# Altium project 1814_TotemLumineux.PrjPcb
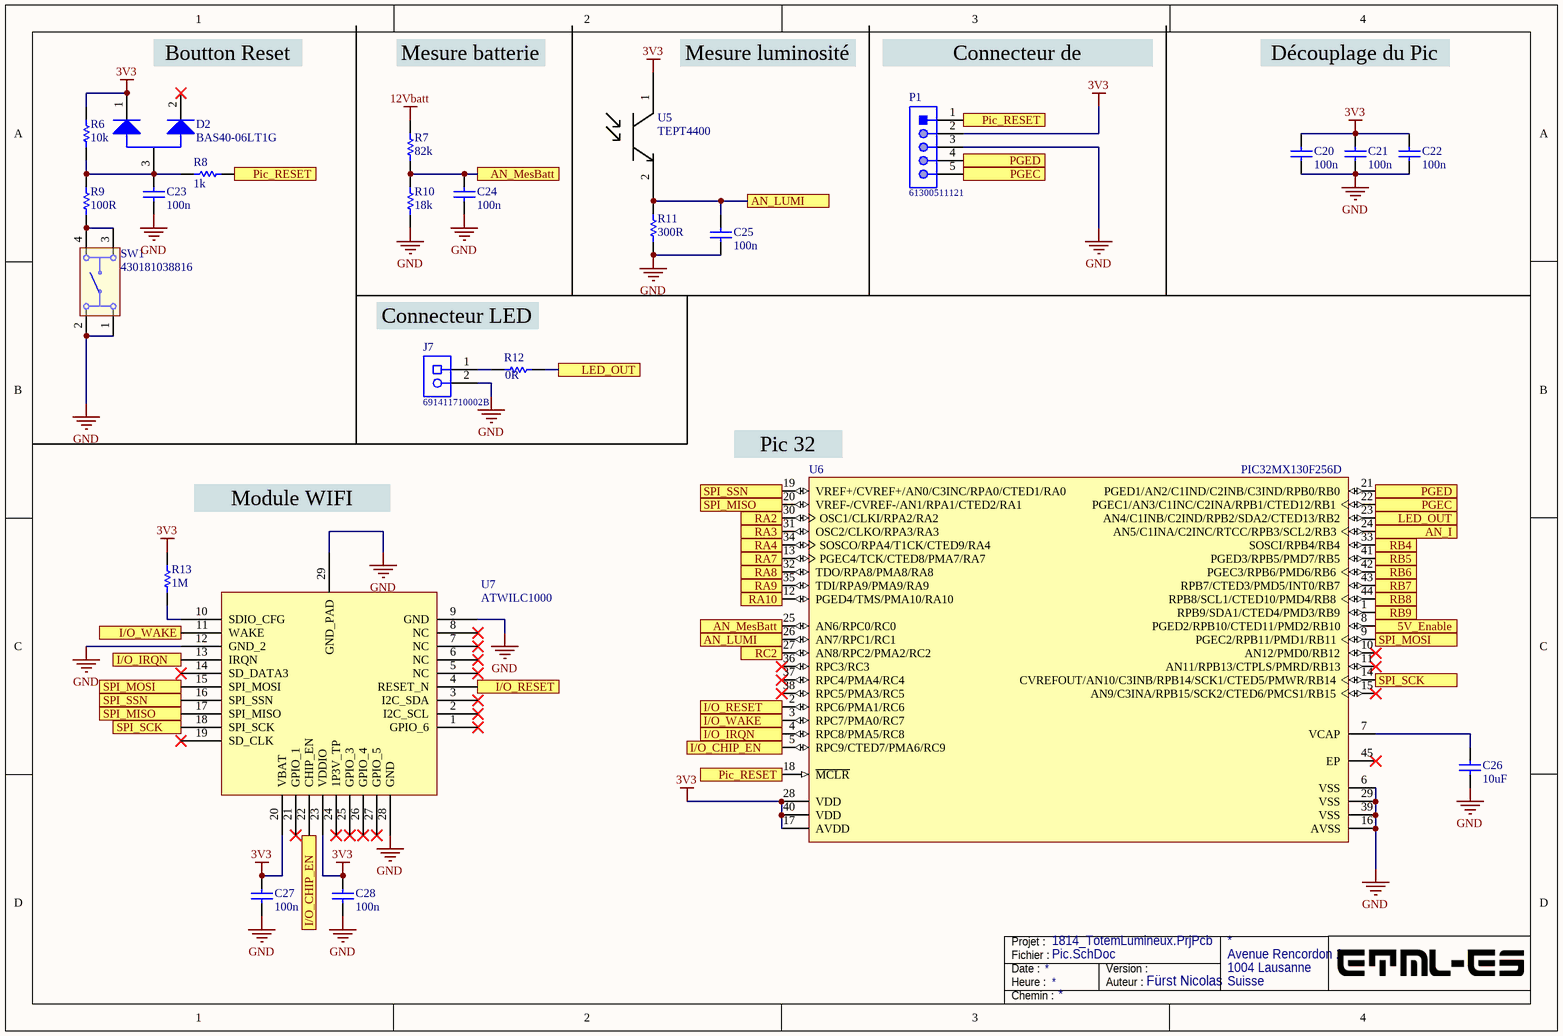
[diagram p0: Pic.SchDoc]
2 sheets, 33 parts. Net scope: flat (ports and power ports of the same name join across sheets).
Board file: Ttem_Lumineux.PcbDoc
Sheets:
  Pic.SchDoc
  Alim.SchDoc

## Sheet Pic.SchDoc
size A4; Author: Fürst Nicolas; CompanyName: ETML-ES; Address1: Avenue Rencordon 1; Address2: 1004 Lausanne; Address3: Suisse

### Parts
C20  100n  [CAPC0805(2012)155_L]
C21  100n  [CAPC0805(2012)155_L]
C22  100n  [CAPC0805(2012)155_L]
C23  100n  [CAPC0805(2012)155_L]
C24  100n  [CAPC0805(2012)155_L]
C25  100n  [CAPC0805(2012)155_L]
C26  10uF  [CAPC0805(2012)155_L]
C27  100n  [CAPC0805(2012)155_L]
C28  100n  [CAPC0805(2012)155_L]
D2  BAS40-06LT1G  [ONSC-SOT-23-3-318-08_V]
J7  691411710002B  [691411710002B]
P1  61300511121  [61300511121]
R6  10k  [RESC0805(2012)_N]
R7  82k  [RESC0805(2012)_N]
R8  1k  [RESC0805(2012)_N]
R9  100R  [RESC0805(2012)_N]
R10  18k  [RESC0805(2012)_N]
R11  300R  [RESC0805(2012)_N]
R12  0R  [RESC0805(2012)_N]
R13  1M  [RESC0805(2012)_N]
SW1  430181038816  [430181038816]
U5  TEPT4400  [Type 3mm]
U6  PIC32MX130F256D  [QFP80P1200X1200X120-44N]
U7  ATWILC1000  [ATWILC1000]

### Ports
5V_Enable, AN_I, AN_LUMI, AN_MesBatt, I/O_CHIP_EN, I/O_IRQN, I/O_RESET, I/O_WAKE, LED_OUT, PGEC, PGED, Pic_RESET, RA2, RA3, RA4, RA7, RA8, RA9, RA10, RB4, RB5, RB6, RB7, RB8, RB9, RC2, SPI_MISO, SPI_MOSI, SPI_SCK, SPI_SSN

### Nets
3V3: C20.2 C21.2 C22.2 C27.2 C28.2 D2.1(K1) P1.2 R6.2 R13.2 U5.1 U6.17(AVDD) U6.28(VDD) U6.40(VDD) U7.20(VBAT) U7.23(VDDIO)
12Vbatt: R7.2
GND: C20.1 C21.1 C22.1 C23.1 C24.1 C25.1 C26.1 C27.1 C28.1 J7.2 P1.3 R10.1 R11.1 SW1.1 SW1.2 U6.6(VSS) U6.16(AVSS) U6.29(VSS) U6.39(VSS) U7.9(GND) U7.12(GND_2) U7.28(GND) U7.29(GND_PAD)
NetC23_2: C23.2 D2.3(A) R6.1 R8.2 R9.2
NetC24_2: C24.2 R7.1 R10.2 U6.25(AN6/RPC0/RC0) ; port AN_MesBatt
NetC25_2: C25.2 R11.2 U5.2 U6.26(AN7/RPC1/RC1) ; port AN_LUMI
NetC26_2: C26.2 U6.7(VCAP)
NetJ5_3: U6.1(RPB9/SDA1/CTED4/PMD3/RB9) ; port RB9
NetJ5_4: U6.12(PGED4/TMS/PMA10/RA10) ; port RA10
NetJ5_5: U6.44(RPB8/SCL1/CTED10/PMD4/RB8) ; port RB8
NetJ5_6: U6.35(TDI/RPA9/PMA9/RA9) ; port RA9
NetJ5_7: U6.43(RPB7/CTED3/PMD5/INT0/RB7) ; port RB7
NetJ5_8: U6.32(TDO/RPA8/PMA8/RA8) ; port RA8
NetJ5_9: U6.42(PGEC3/RPB6/PMD6/RB6) ; port RB6
NetJ5_10: U6.13(PGEC4/TCK/CTED8/PMA7/RA7) ; port RA7
NetJ5_11: U6.41(PGED3/RPB5/PMD7/RB5) ; port RB5
NetJ5_12: U6.34(SOSCO/RPA4/T1CK/CTED9/RA4) ; port RA4
NetJ5_13: U6.33(SOSCI/RPB4/RB4) ; port RB4
NetJ5_14: U6.31(OSC2/CLKO/RPA3/RA3) ; port RA3
NetJ5_15: U6.27(AN8/RPC2/PMA2/RC2) ; port RC2
NetJ5_16: U6.30(OSC1/CLKI/RPA2/RA2) ; port RA2
NetJ7_1: J7.1 R12.2
NetP1_1: P1.1 R8.1 U6.18(~{MCLR}) ; port Pic_RESET
NetP1_4: P1.4 U6.21(PGED1/AN2/C1IND/C2INB/C3IND/RPB0/RB0) ; port PGED
NetP1_5: P1.5 U6.22(PGEC1/AN3/C1INC/C2INA/RPB1/CTED12/RB1) ; port PGEC
NetR9_1: R9.1 SW1.3 SW1.4
NetR12_1: R12.1 U6.23(AN4/C1INB/C2IND/RPB2/SDA2/CTED13/RB2) ; port LED_OUT
NetR13_1: R13.1 U7.10(SDIO_CFG)
NetU4_6: U6.24(AN5/C1INA/C2INC/RTCC/RPB3/SCL2/RB3) ; port AN_I
NetU6_2: U6.2(RPC6/PMA1/RC6) U7.4(RESET_N) ; port I/O_RESET
NetU6_3: U6.3(RPC7/PMA0/RC7) U7.11(WAKE) ; port I/O_WAKE
NetU6_4: U6.4(RPC8/PMA5/RC8) U7.13(IRQN) ; port I/O_IRQN
NetU6_5: U6.5(RPC9/CTED7/PMA6/RC9) U7.22(CHIP_EN) ; port I/O_CHIP_EN
NetU6_8: U6.8(PGED2/RPB10/CTED11/PMD2/RB10) ; port 5V_Enable
NetU6_9: U6.9(PGEC2/RPB11/PMD1/RB11) U7.15(SPI_MOSI) ; port SPI_MOSI
NetU6_14: U6.14(CVREFOUT/AN10/C3INB/RPB14/SCK1/CTED5/PMWR/RB14) U7.18(SPI_SCK) ; port SPI_SCK
NetU6_19: U6.19(VREF+/CVREF+/AN0/C3INC/RPA0/CTED1/RA0) U7.16(SPI_SSN) ; port SPI_SSN
NetU6_20: U6.20(VREF-/CVREF-/AN1/RPA1/CTED2/RA1) U7.17(SPI_MISO) ; port SPI_MISO

Not connected (* = marked no-connect by the designer): D2 2(K2)*; U6 10(AN12/PMD0/RB12)* 11(AN11/RPB13/CTPLS/PMRD/RB13)* 15(AN9/C3INA/RPB15/SCK2/CTED6/PMCS1/RB15)* 36(RPC3/RC3)* 37(RPC4/PMA4/RC4)* 38(RPC5/PMA3/RC5)* 45(EP)*; U7 1(GPIO_6)* 2(I2C_SCL)* 3(I2C_SDA)* 5(NC)* 6(NC)* 7(NC)* 8(NC)* 14(SD_DATA3)* 19(SD_CLK)* 21(GPIO_1)* 24(1P3V_TP)* 25(GPIO_3)* 26(GPIO_4)* 27(GPIO_5)*

### Notes on the sheet
- Boutton Reset
- Mesure batterie
- Mesure luminosité
- Connecteur de programmation
- Découplage du Pic
- Connecteur LED
- Module WIFI
- (near U6) Pic 32
- Fichier :
- Date :
- Heure :
- Projet :
- Auteur :
- Version :
- Chemin :

### Library data of the parts
C20-C28 = Capa: Case-EIA: 0805; Rated Voltage: 10 V; Value: 4.7uF; Tolerance: Â±10%; Case-Metric: 2012; Max Thickness: 1.55 mm; Technology: SMT
D2 = CMP-1055-00547-1: Common Anode Schottky Barrier Diodes, 3-Pin SOT-23, Pb-Free, Tape and Reel; Manufacturer: On Semiconductor; ComponentLink3URL: http://www.onsemi.cn/pub_link/Collateral/318-08.PDF; Packing: Tape and Reel; PackageReference: SOT-23-3-318-08; ComponentLink1Description: Manufacturer URL; PackageDescription: 3-Pin Small Outline Transistor, Body 2.92 x 1.3 mm, Pitch 0.95 mm; ComponentLink1URL: http://www.onsemi.com/; Configuration: Common Anode; Mounting Technology: Surface Mount; RoHS: TRUE; PartNumber: BAS40-06LT1G; ComponentLink3Description: Package Specification; ComponentLink2Description: Datasheet; PackageVersion: Rev. AP, 11/2009; ComponentLink2URL: http://www.onsemi.cn/pub_link/Collateral/BAS40-06LT1-D.PDF; DatasheetVersion: Rev. 8
J7 = CMP-1502-03026-1: Serie 411 B - 5.00mm Screwless Horizontal Entry-2.0mm2 Wires WR-TBL, 2 pin; Manufacturer: Wurth Elektronik; Pin Number: 2; Publisher: WurthElektronik; Pitch: 5.00mm; Package Reference: 691411710002B; Datasheet URL: http://katalog.we-online.de/em/datasheet/6914117100xxB.pdf; Mounting Technology: THT; Manufacturer URL: http://www.we-online.de; Packaging: Box; Part Number: 691411710002B; Operating Temperature: -40to105degC
P1 = CMP-1502-01068-1: THT Vertical Pin Header WR-PHD, Pitch 2.54 mm, Single Row, 5 pins; Manufacturer: Wurth Elektronik; Pin Number: 5; Contact Resistance: 20mOhm; Working Voltage: 250VAC; Pitch: 2.54mm; Withstanding Voltage: 500VAC; Rated Current: 3A; Gender: Male; Datasheet URL: https://katalog.we-online.de/em/datasheet/6130xx11121.pdf; Orientation: Vertical; Mounting Technology: THT; Row Number: Single; Package Reference: 61300511121; Publisher: WurthElektronik; Part Number: 61300511121; Packaging: Bag; Manufacturer URL: http://www.we-online.de; Operating Temperature: -40to105degC
R6-R13 = Resistor: Value: 1000000.00 Ohm; Case-Metric: 2012; Case-EIA: 0805; Power: 0.125 W; Tolerance: 1 %; Technology: SMT
SW1 = CMP-1454-00001-1: WS-TASV SMD Tact Switch 4.5X4.5 mm; Manufacturer: Wuerth Elektronik; NoPins: 04; PartNumber: 430181038816; ComponentLink1Description: Manufacturer URL; ComponentLink2URL: http://katalog.we-online.de/em/datasheet/430181038816.pdf; ComponentLink1URL: http://www.we-online.com; PackageReference: 430181038816; ComponentLink2Description: Datasheet
U6 = PIC32MX130F256D: PartNumber: PIC32MX130F064D-I/TL; Manufacturer: Microchip; Mounting Technology: Surface Mount; ComponentLink4Description: Product URL; DatasheetVersion: Rev. E; ComponentLink4URL: http://www.microchip.com/PIC32MX130F064D; PackageVersion: C04-157C; ComponentLink3URL: http://www.microchip.com/stellent/groups/techpub_sg/documents/packagingspec/en012702.pdf; PackageDescription: 44-Lead Terminal Very Thin Leadless Array Package, 6 x 6 mm Body, 0.5 mm Pitch; ComponentLink2URL: http://ww1.microchip.com/downloads/en/DeviceDoc/61168E.pdf; ComponentLink1URL: http://www.microchip.com; PackageReference: VTLA-TL44; ComponentLink2Description: Datasheet; ComponentLink3Description: Package Specification; ComponentLink1Description: Manufacturer URL

## Sheet Alim.SchDoc
size A4; Author: Fürst Nicolas; CompanyName: ETML-ES; Address1: Avenue Rencordon 1; Address2: 1004 Lausanne; Address3: Suisse; SheetNumber: 2; SheetTotal: 2
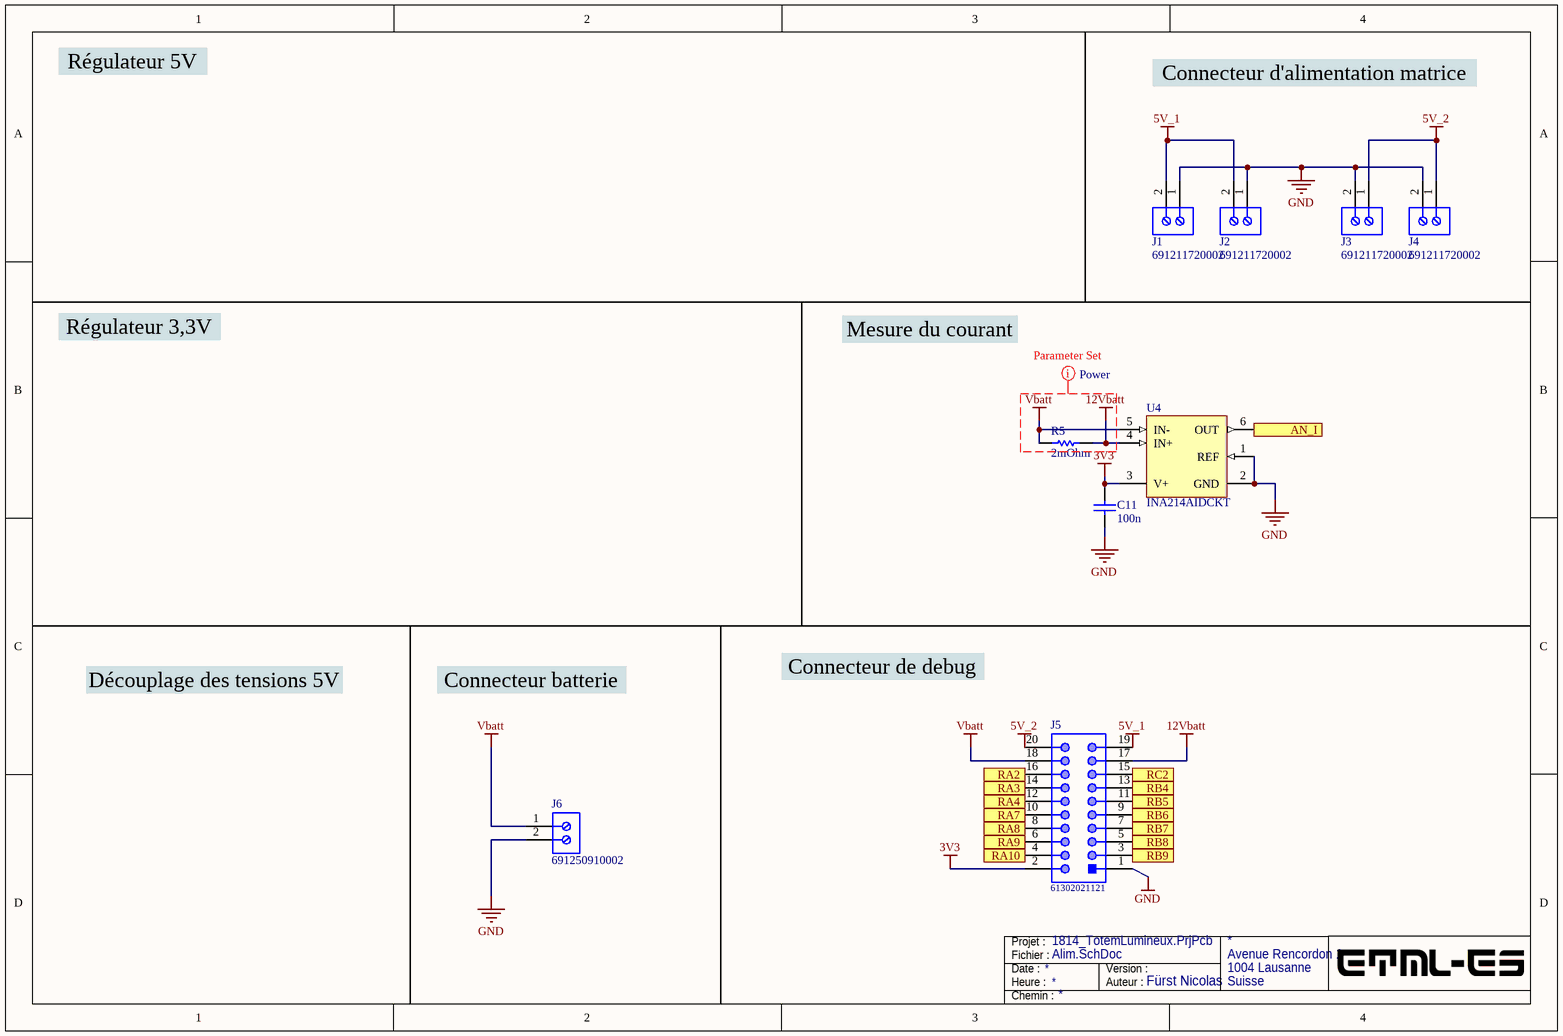
[diagram p1: Alim.SchDoc]

### Parts
C11  100n  [CAPC0805(2012)155_L]
J1  691211720002  [691211720002]
J2  691211720002  [691211720002]
J3  691211720002  [691211720002]
J4  691211720002  [691211720002]
J5  61302021121  [61302021121]
J6  691250910002  [691250910002]
R5  2mOhm  [RESC1206(3216)_N]
U4  INA214AIDCKT  [DCK0006A_N]

### Ports
AN_I, RA2, RA3, RA4, RA7, RA8, RA9, RA10, RB4, RB5, RB6, RB7, RB8, RB9, RC2

### Nets
3V3: C11.1 J5.2 U4.3(V+)
5V_1: J1.2 J2.2 J5.19
5V_2: J3.1 J4.1 J5.20
12Vbatt: J5.17 R5.1 U4.4(IN+)
GND: C11.2 J1.1 J2.1 J3.2 J4.2 J5.1 J6.2 U4.1(REF) U4.2(GND)
Vbatt: J5.18 J6.1 R5.2 U4.5(IN-)
NetJ5_3: J5.3 ; port RB9
NetJ5_4: J5.4 ; port RA10
NetJ5_5: J5.5 ; port RB8
NetJ5_6: J5.6 ; port RA9
NetJ5_7: J5.7 ; port RB7
NetJ5_8: J5.8 ; port RA8
NetJ5_9: J5.9 ; port RB6
NetJ5_10: J5.10 ; port RA7
NetJ5_11: J5.11 ; port RB5
NetJ5_12: J5.12 ; port RA4
NetJ5_13: J5.13 ; port RB4
NetJ5_14: J5.14 ; port RA3
NetJ5_15: J5.15 ; port RC2
NetJ5_16: J5.16 ; port RA2
NetU4_6: U4.6(OUT) ; port AN_I

### Layout directives
net class Power: 12Vbatt, Vbatt

### Notes on the sheet
- Régulateur 5V
- Connecteur d'alimentation matrice
- Régulateur 3,3V
- Mesure du courant
- Découplage des tensions 5V
- Connecteur batterie
- Connecteur de debug
- Fichier :
- Date :
- Heure :
- Projet :
- Auteur :
- Version :
- Chemin :

### Library data of the parts
C11 = Capa: as C20 on sheet Pic; Max Thickness: 1.55 mm; Technology: SMT
J1-J4 = CMP-1502-02524-1: Serie 211 - 5.00 mm 45deg Entry Modular with Rising Cage Clamp - 15.50 mm Height WR-TBL, 2 pin; Manufacturer: Wurth Elektronik; Pitch: 5.00mm; Pin Number: 2; Manufacturer URL: http://www.we-online.de; Mounting Technology: THT; Packaging: Box; Datasheet URL: http://katalog.we-online.de/em/datasheet/6912117200xx.pdf; Operating Temperature: -40to105degC; Package Reference: 691211720002; Part Number: 691211720002; Publisher: WurthElektronik
J5 = CMP-1502-01104-1: THT Vertical Pin Header WR-PHD, Pitch 2.54 mm, Dual Row, 20 pins; Manufacturer: Wurth Elektronik; Pin Number: 20; Withstanding Voltage: 500VAC; Contact Resistance: 20mOhm; Gender: Male; Working Voltage: 250VAC; Pitch: 2.54mm; Rated Current: 3A; Datasheet URL: https://katalog.we-online.de/em/datasheet/6130xx21121.pdf; Mounting Technology: THT; Package Reference: 61302021121; Manufacturer URL: http://www.we-online.de; Part Number: 61302021121; Orientation: Vertical; Operating Temperature: -40to105degC; Row Number: Dual; Publisher: WurthElektronik; Packaging: Bag
J6 = CMP-1502-02750-1: Serie 2509 - 9.52 mm Horizontal Entry Modular with Rising Cage Clamp WR-TBL, 2 pin; Manufacturer: Wurth Elektronik; Pin Number: 2; Pitch: 9.52mm; Datasheet URL: http://katalog.we-online.de/em/datasheet/6912509100XX.pdf; Mounting Technology: THT; Package Reference: 691250910002; Publisher: WurthElektronik; Packaging: Box; Manufacturer URL: http://www.we-online.de; Operating Temperature: -30to120degC; Part Number: 691250910002
R5 = Resistor: as R6 on sheet Pic; Technology: SMT
U4 = CMP-2000-06456-1: Voltage Output, High / Low-Side Measurement, Bi-Directional Zero-Drift Series, Current Shunt Monitor, 2.7 to 26 V, -40 to 125 degC, 6-Pin SOT-23 (DCK6), Green (RoHS & no Sb/Br), Tape and Reel; Package Version: 4093553-4/G, 01/2007; Development Kit: INA210-214EVM; Unit Weight: 0.000088oz; Vcm - Common Mode Voltage: -0.3Vto+26V; Gain V/V: 100V/V; Operating Supply Current: 115uA; Topology: CurrentShuntFeedback; Number of Channels: 1Channel; Accuracy: 1%; Amplifier Type: CurrentSense; Gain Error: 0.02%; Vos - Input Offset Voltage: 60uV; Brand: TexasInstruments; Supply Voltage - Max: 26V; CMRR - Common Mode Rejection Ratio: 105dB; Supply Voltage - Min: 2.7V; GBP - Gain Bandwidth Product: 30kHz; Product Category: CurrentSenseAmplifiers; Series: INA214; Mounting Style: SMD/SMT; Datasheet URL: http://www.ti.com/lit/gpn/INA214?keyMatch=INA214AIDCKT&tisearch=Search-EN-Everything; Maximum Operating Temperature: +125C; Package / Case: SOT-23-6; Minimum Operating Temperature: -40C; Datasheet Version: Rev. G, 07/2014; RoHS: True; Manufacturer URL: http://www.ti.com/; Package Description: 6-Pin Plastic Small Outline, Body 2 x 1.25 mm, Pitch 0.65 mm; Product: CurrentSenseAmplifiers; Package Reference: DCK6; Packaging: Reel; Manufacturer: TexasInstruments; Mounting Technology: SurfaceMount

## Nets that join several sheets
3V3: Pic (15 pins), Alim (C11.1 J5.2 U4.3)
12Vbatt: Pic (R7.2), Alim (J5.17 R5.1 U4.4)
GND: Pic (23 pins), Alim (9 pins)
NetJ5_3: Pic (U6.1), Alim (J5.3)
NetJ5_4: Pic (U6.12), Alim (J5.4)
NetJ5_5: Pic (U6.44), Alim (J5.5)
NetJ5_6: Pic (U6.35), Alim (J5.6)
NetJ5_7: Pic (U6.43), Alim (J5.7)
NetJ5_8: Pic (U6.32), Alim (J5.8)
NetJ5_9: Pic (U6.42), Alim (J5.9)
NetJ5_10: Pic (U6.13), Alim (J5.10)
NetJ5_11: Pic (U6.41), Alim (J5.11)
NetJ5_12: Pic (U6.34), Alim (J5.12)
NetJ5_13: Pic (U6.33), Alim (J5.13)
NetJ5_14: Pic (U6.31), Alim (J5.14)
NetJ5_15: Pic (U6.27), Alim (J5.15)
NetJ5_16: Pic (U6.30), Alim (J5.16)
NetU4_6: Pic (U6.24), Alim (U4.6)